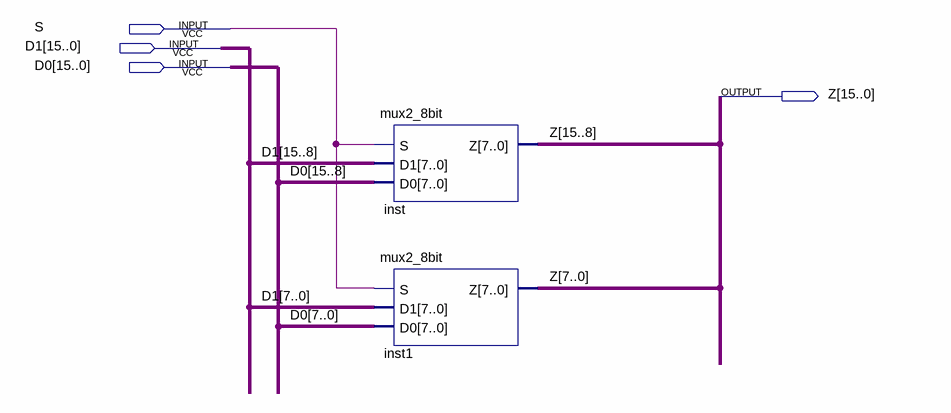
[diagram p0: schematic sheet]
// Quartus schematic mux2_16bit.bdf as structural Verilog: 2 symbols, 4 pins
module mux2_16bit (
  input  S,
  input  [15:0] D1,
  input  [15:0] D0,
  output [15:0] Z
);

  mux2_8bit inst (.S(S), .D1(D1[15:8]), .D0(D0[15:8]), .Z(Z[15:8]));
  mux2_8bit inst1 (.S(S), .D1(D1[7:0]), .D0(D0[7:0]), .Z(Z[7:0]));
endmodule
